# Altium project Carrier-Board-v1.0.PrjPcb (part 6 of 15)

## Sheet USB-C_INTERFACE.SchDoc
size A4; SheetNumber: 12; SheetTotal: 27
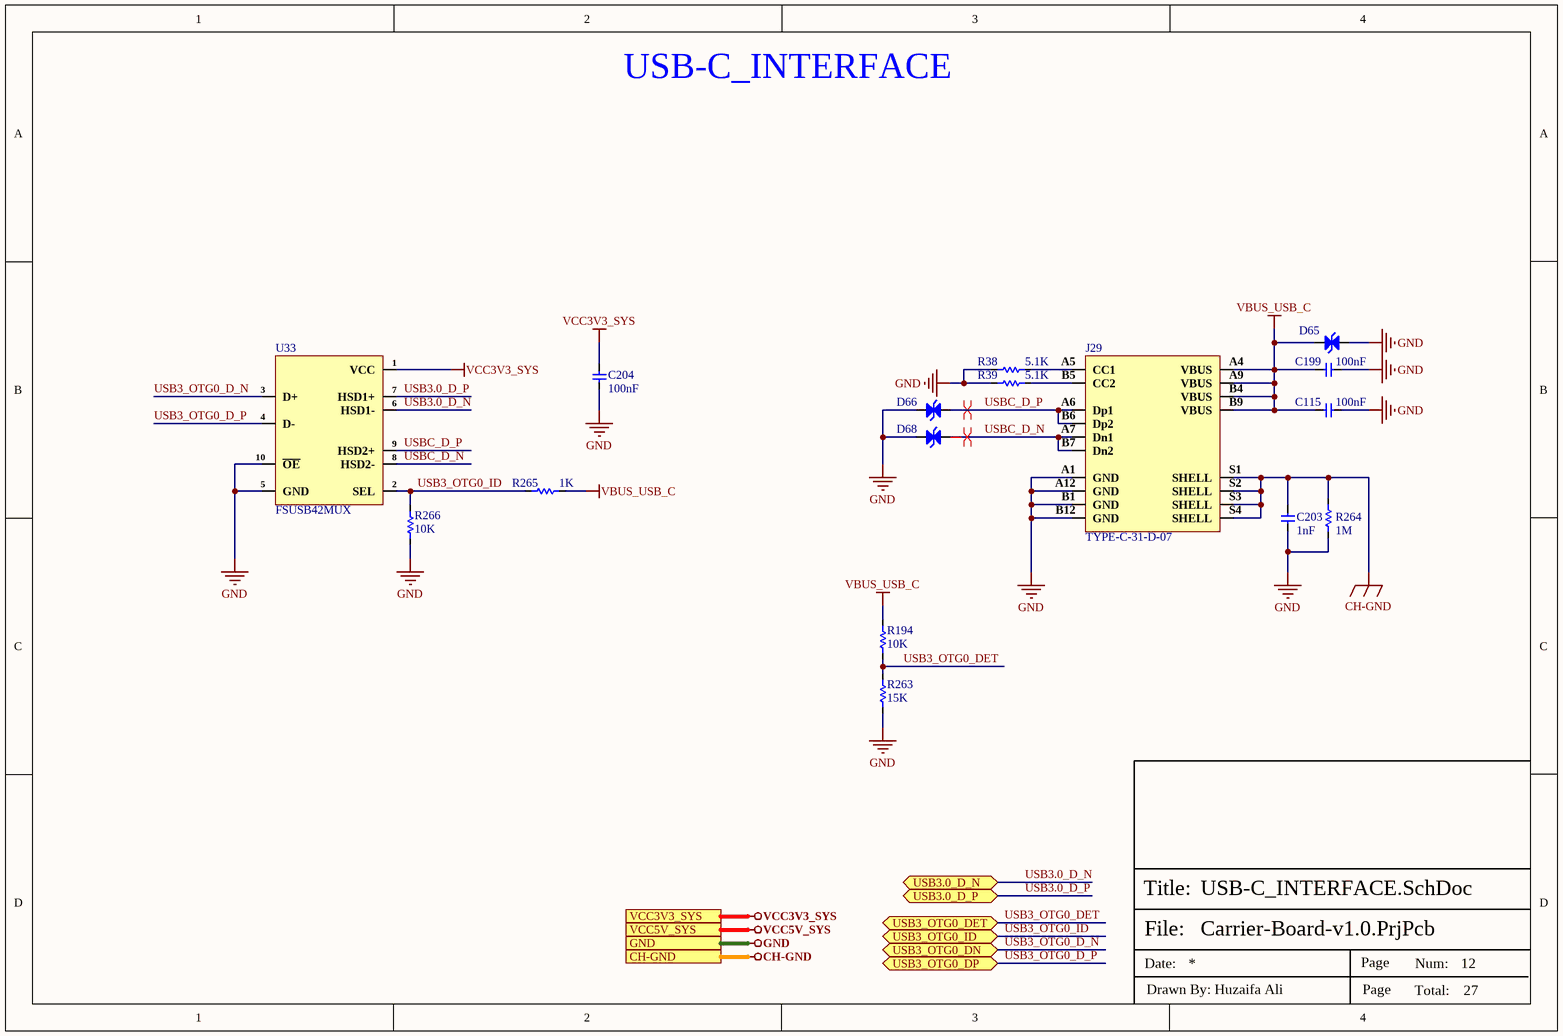
[diagram p11: USB-C_INTERFACE.SchDoc]

### Parts
C115  100nF  [Cap-0402]
C199  100nF  [Cap-0402]
C203  1nF  [Cap-1206]
C204  100nF  [Cap-0402]
D65  ESD5451N  [DFN1006-2L (Bi-Directional)]  (value not drawn)
D66  ESD5451N  [DFN1006-2L (Bi-Directional)]  (value not drawn)
D68  ESD5451N  [DFN1006-2L (Bi-Directional)]  (value not drawn)
J29  TYPE-C-31-D-07  [TYPE-C-31-D-07]
R38  5.1K  [Res-0402]
R39  5.1K  [Res-0402]
R194  10K  [Res-0402]
R263  15K  [Res-0402]
R264  1M  [Res-0402]
R265  1K  [Res-0402]
R266  10K  [Res-0402]
U33  FSUSB42MUX  [10-MSOP]

### Ports
CH-GND (see TOP SHEET[3D], ETHERNET_PHY0[4D], ETHERNET_PHY1[4D], HDMI_INTERFACE[3D], MICRO_SD_INTERFACE[3D], USB2.0_INTERFACE[3D], USB3.0_INTERFACE[3D]), GND (see TOP SHEET[3D], AUDIO_INTERFACE[1D], BUCK REGULATOR[3D], DEBUG_UART_INTERFACE[3D], DIGITAL IO_RELAY_SHEET[5D], DUAL_SIM_INTERFACE[3D], ETHERNET_PHY0[4D], ETHERNET_PHY1[4D], GSM_INTERFACE[2D], HDMI_INTERFACE[3D], INPUT_PROTECTION[3D], LINEAR_VOLTAGE_REG[3D], MICRO_SD_INTERFACE[3D], MIPI-DSI DISPLAY[3D], POWER SECTION[3D], PUSH BUTTONs_INTERFACE[3C], RGB_LEDs_INTERFACE[3D], ROCKCHIP_PWR_SUPPLY[1D], ROCKCHIP_SYSTEM_CONTROL[3C], RS232_RS485_INTERFACE[3C], SENSOR_SHEET[3D], USB2.0_INTERFACE[3D], USB3.0_INTERFACE[3D], WIEGAND_INTERFACE[3D], WIFI_BLUETOOTH_SHEET[4C]), USB3.0_D_N (bidir, see TOP SHEET[3C], USB3.0_INTERFACE[3D]), USB3.0_D_P (bidir, see TOP SHEET[3C], USB3.0_INTERFACE[3D]), USB3_OTG0_DET (bidir, see TOP SHEET[3C], USB3.0_INTERFACE[3D]), USB3_OTG0_DN (bidir, see TOP SHEET[3C], USB3.0_INTERFACE[3D]), USB3_OTG0_DP (bidir, see TOP SHEET[3C], USB3.0_INTERFACE[3D]), USB3_OTG0_ID (bidir, see TOP SHEET[3C], USB3.0_INTERFACE[3D]), VCC3V3_SYS (see TOP SHEET[3C], AUDIO_INTERFACE[1D], BUCK REGULATOR[3D], DEBUG_UART_INTERFACE[3D], DIGITAL IO_RELAY_SHEET[5D], ETHERNET_PHY0[4D], ETHERNET_PHY1[4D], GSM_INTERFACE[2D], HDMI_INTERFACE[3D], LINEAR_VOLTAGE_REG[3D], MIPI-DSI DISPLAY[3D], POWER SECTION[3D], PUSH BUTTONs_INTERFACE[3C], ROCKCHIP_PWR_SUPPLY[1D], ROCKCHIP_SYSTEM_CONTROL[3C], RS232_RS485_INTERFACE[3C], SENSOR_SHEET[3D], WIEGAND_INTERFACE[3D], WIFI_BLUETOOTH_SHEET[4C]), VCC5V_SYS (see TOP SHEET[3C], BUCK REGULATOR[3D], DIGITAL IO_RELAY_SHEET[5D], HDMI_INTERFACE[3D], LINEAR_VOLTAGE_REG[3D], MIPI-DSI DISPLAY[3D], POWER SECTION[3D], RGB_LEDs_INTERFACE[3D], ROCKCHIP_PWR_SUPPLY[1D], USB2.0_INTERFACE[3D], USB3.0_INTERFACE[3D], WIEGAND_INTERFACE[3D])

### Nets
CH-GND: C203.2 J29.S1(SHELL) J29.S2(SHELL) J29.S3(SHELL) J29.S4(SHELL) R264.2 ; port CH-GND
GND: C115.1 C199.1 C203.1 C204.1 D65.1(K) D66.2(K) D68.2(K) J29.A1(GND) J29.A12(GND) J29.B1(GND) J29.B12(GND) R38.1 R39.1 R263.1 R264.1 R266.2 U33.5(GND) U33.10(~{OE}) ; port GND
VBUS_USB_C: C115.2 C199.2 D65.2(K) J29.A4(VBUS) J29.A9(VBUS) J29.B4(VBUS) J29.B9(VBUS) R194.1 R265.2
VCC3V3_SYS: C204.2 U33.1(VCC) ; port VCC3V3_SYS
USB3.0_D_N: U33.6(HSD1-) ; port USB3.0_D_N
USB3.0_D_P: U33.7(HSD1+) ; port USB3.0_D_P
USB3_OTG0_D_N: U33.3(D+) ; port USB3_OTG0_DN
USB3_OTG0_D_P: U33.4(D-) ; port USB3_OTG0_DP
USB3_OTG0_DET: R194.2 R263.2 ; port USB3_OTG0_DET
USB3_OTG0_ID: R265.1 R266.1 U33.2(SEL) ; port USB3_OTG0_ID
USBC_D_N: D68.1(K) J29.A7(Dn1) J29.B7(Dn2) U33.8(HSD2-)
USBC_D_P: D66.1(K) J29.A6(Dp1) J29.B6(Dp2) U33.9(HSD2+)
NetJ29_A5: J29.A5(CC1) R38.2
NetJ29_B5: J29.B5(CC2) R39.2

### Layout directives
differential pair; differential pair class DIFF-USB-90; rule Matched Net Lengths [Tolerance = 0.508mm]; rule Impedance Constraint [Min = 85.00    Max = 95.00    ]: USBC_D_N, USBC_D_P

### Notes on the sheet
- USB-C_INTERFACE
- File:
- Title:
- Date:
- Page
- Num:
- Total:
- Drawn By: Huzaifa Ali

### Library data of the parts
C115 C199 C204 = CC0402KRX5R7BB104: CAP CER 0.1UF 16V X5R 0402; Manufacturer: Yageo; Tolerance: 10%; Supplier 1: Mouser; Manufacturer Part Number: CC0402KRX5R7BB104; RoHS: Yes; Category: Ceramic Capacitors; Stock 1: 936792; Pricing 1: 1=0.10000, 10=0.02300, 50=0.02300, 100=0.01100, 1000=0.00600, 10000=0.00400 (USD); Mount: Surface Mount; Case/Package: 0402; Case Code (Metric): 1005; Case Code (Imperial): 0402; Min Operating Temperature: -55°C; Max Operating Temperature: 85°C; Capacitance: 100nF; Packaging: Tape and Reel; Voltage Rating: 16V; Dielectric: X5R; Termination: SMD/SMT; Voltage Rating (DC): 16V; Package Quantity: 1; Series: CC; Length: 1mm; Width: 0.02inch; Height: 0.5mm; Thickness: 0.022inch; Lead Free: Lead Free; RoHS Compliant: Yes; ComponentLink1URL: https://datasheet.ciiva.com/155/mlccorderingcode-155879.pdf?src-supplier=Digi-Key; ComponentLink1Description: https://datasheet.ciiva.com/155/mlccorderingcode-155879.pdf?src-supplier=Digi-Key; ComponentLink2URL: https://datasheet.ciiva.com/155/mlccorderingcode-155878.pdf?src-supplier=Digi-Key; ComponentLink2Description: https://datasheet.ciiva.com/155/mlccorderingcode-155878.pdf?src-supplier=Digi-Key; ComponentLink3URL: https://datasheet.ciiva.com/155/mlccorderingcode-155880.pdf?src-supplier=Digi-Key; ComponentLink3Description: https://datasheet.ciiva.com/155/mlccorderingcode-155880.pdf?src-supplier=Digi-Key; ComponentLink4URL: https://datasheet.ciiva.com/11464/upy-gphc-x5r-4v-to-50v-12-11464869.pdf?src-supplier=Avnet; ComponentLink4Description: https://datasheet.ciiva.com/11464/upy-gphc-x5r-4v-to-50v-12-11464869.pdf?src-supplier=Avnet; Supplier Part Number 1: 603-CC402KRX5R7BB104; LCSC Part Number: C106204; Number of Pins: 2; Resistor Type: Ceramic; Construction: Flat; Depth: 0.5mm; Radiation Hardening: No; REACH SVHC: Unknown; Halogen Free: Halogen Free
C203 = CC1206KKX7RDBB102: CAP CER 1000PF 2KV X7R 1206; Manufacturer: Yageo; Tolerance: 10%; Dissipation Factor: 2.5%; Insulation Resistance: 10GR; Item Type: Capacitor; Manufacturer Part Number: CC1206KKX7RDBB102; RoHS: Yes; Category: Ceramic Capacitors; Case/Package: 1206; Case Code (Metric): 3216; Case Code (Imperial): 1206; Min Operating Temperature: -55°C; Max Operating Temperature: 125°C; Voltage Rating: 2kV; Packaging: Tape and Reel; Dielectric: X7R; Termination: SMD/SMT; Voltage Rating (DC): 2kV; Series: CC; Construction: Flat; Length: 3.2mm; RoHS Compliant: Yes; ComponentLink1URL: https://datasheet.ciiva.com/23942/1449957-23942422.pdf?src-supplier=Newark; ComponentLink1Description: https://datasheet.ciiva.com/23942/1449957-23942422.pdf?src-supplier=Newark; ComponentLink2URL: https://datasheet.ciiva.com/186/upy-np0x7r-hv-1kv-to-3kv-4-186736.pdf?src-supplier=Digi-Key; ComponentLink2Description: https://datasheet.ciiva.com/186/upy-np0x7r-hv-1kv-to-3kv-4-186736.pdf?src-supplier=Digi-Key; ComponentLink3URL: https://datasheet.ciiva.com/186/upy-np0x7r-hv-1kv-to-3kv-4-186737.pdf?src-supplier=Digi-Key; ComponentLink3Description: https://datasheet.ciiva.com/186/upy-np0x7r-hv-1kv-to-3kv-4-186737.pdf?src-supplier=Digi-Key; ComponentLink4URL: https://datasheet.ciiva.com/13386/upy-gp-np0-16v-to-50v-8-13386312.pdf?src-supplier=Mouser; ComponentLink4Description: https://datasheet.ciiva.com/13386/upy-gp-np0-16v-to-50v-8-13386312.pdf?src-supplier=Mouser; ComponentLink5URL: https://datasheet.ciiva.com/186/upy-np0x7r-hv-1kv-to-3kv-4-186735.pdf?src-supplier=Digi-Key; ComponentLink5Description: https://datasheet.ciiva.com/186/upy-np0x7r-hv-1kv-to-3kv-4-186735.pdf?src-supplier=Digi-Key; Supplier 1: Digi-Key; Stock 1: 19260; Pricing 1: 1=0.35000, 10=0.24000, 50=0.16780, 100=0.14390, 500=0.10794, 1000=0.09114 (USD); Mount: Surface Mount; Number of Pins: 2; Capacitance: 1nF; Voltage: 2kV; Package Quantity: 1; Resistor Type: Ceramic; Width: 0.063inch; Height: 1.25mm; Depth: 1.6mm; Thickness: 0.057inch; Radiation Hardening: No; REACH SVHC: Unknown; Lead Free: Lead Free; Supplier Part Number 1: 311-1487-1-ND; LCSC Part Number: C23631
D65 D66 D68 = ESD5451N: DFN1006-2(0402) ESD Protection Devices ROHS; Manufacturer: TECH PUBLIC; Manufacturer Part Number: ESD5451N; Footprint: DFN1006-2(0402); ComponentLink1Description: LCSC; ComponentLink1URL: https://www.lcsc.com/product-detail/span-style-background-color-ff0-ESD-span-Protection-Devices_TECH-PUBLIC-ESD5451N_C2936977.html; LCSC Part Number: C2936977
J29 = TYPE-C-31-D-07: 1 Brick nogging 14P Female Type-C SMD USB Connectors ROHS; Manufacturer: Korean Hroparts Elec; Manufacturer Part Number: TYPE-C-31-D-07; Package: SMD; Item Type: USB Connector; ComponentLink1Description: LCSC; ComponentLink1URL: https://www.lcsc.com/product-detail/USB-Connectors_Korean-Hroparts-Elec-TYPE-C-31-D-07_C2689965.html
R38 R39 = RC0402FR-075K1L: RES 5.1K OHM 1% 1/16W 0402; Manufacturer: Yageo; Power Rating: 63mW; Resistance: 5.1kR; Temperature Coefficient: 100ppm/°C; Voltage Rating: 50V; Item Type: Resistor; Supplier 1: Avnet; Manufacturer Part Number: RC0402FR-075K1L; RoHS: Yes; Category: Chip SMD Resistors; Stock 1: 65000; Pricing 1: 10000=0.00085 (USD); Case/Package: 0402; Case Code (Metric): 1005; Case Code (Imperial): 0402; Min Operating Temperature: -55°C; Max Operating Temperature: 155°C; Tolerance: 1%; Technology: THICK FILM; Packaging: Tape and Reel; Package Quantity: 1; Resistor Type: Thick Film; Number of Terminations: 2; Termination: SMD/SMT; Max Power Dissipation: 63mW; Voltage Rating (DC): 50V; Working Voltage: 50V; Features: Moisture Resistant; Series: RC; Resistance Tolerance: 1%; Construction: Rectangular; Length: 1mm; Width: 0.02inch; Height: 0.016inch; Depth: 0.5mm; RoHS Compliant: Yes; Military Standard: Not; Lead Free: Lead Free; ComponentLink1URL: https://datasheet.ciiva.com/7983/1018594-7983519.pdf?src-supplier=Element14; ComponentLink1Description: https://datasheet.ciiva.com/7983/1018594-7983519.pdf?src-supplier=Element14; ComponentLink2URL: https://datasheet.ciiva.com/46394/1018594-46394936.pdf?src-supplier=Element14; ComponentLink2Description: https://datasheet.ciiva.com/46394/1018594-46394936.pdf?src-supplier=Element14; ComponentLink3URL: https://datasheet.ciiva.com/2453/pyu-r-int-thick-7-2453401.pdf?src-supplier=Digi-Key; ComponentLink3Description: https://datasheet.ciiva.com/2453/pyu-r-int-thick-7-2453401.pdf?src-supplier=Digi-Key; ComponentLink4URL: https://datasheet.ciiva.com/2453/pyu-r-int-thick-7-2453402.pdf?src-supplier=Digi-Key; ComponentLink4Description: https://datasheet.ciiva.com/2453/pyu-r-int-thick-7-2453402.pdf?src-supplier=Digi-Key; ComponentLink5URL: https://datasheet.ciiva.com/2453/pyu-r-int-thick-7-2453400.pdf?src-supplier=Digi-Key; ComponentLink5Description: https://datasheet.ciiva.com/2453/pyu-r-int-thick-7-2453400.pdf?src-supplier=Digi-Key; ComponentLink6URL: https://datasheet.ciiva.com/12558/pyu-rc0402-51-rohs-l-6-r-8721-12558460.pdf?src-supplier=Mouser; ComponentLink6Description: https://datasheet.ciiva.com/12558/pyu-rc0402-51-rohs-l-6-r-8721-12558460.pdf?src-supplier=Mouser; ComponentLink7URL: https://datasheet.ciiva.com/16744/pyu-rc0402-51-rohs-l-6-r-16744283.pdf?src-supplier=Future+Electronics; ComponentLink7Description: https://datasheet.ciiva.com/16744/pyu-rc0402-51-rohs-l-6-r-16744283.pdf?src-supplier=Future+Electronics; ComponentLink8URL: https://datasheet.ciiva.com/15189/getdatasheetpartid-323636-15189493.pdf?src-supplier=Verical; ComponentLink8Description: https://datasheet.ciiva.com/15189/getdatasheetpartid-323636-15189493.pdf?src-supplier=Verical; Supplier Part Number 1: RC0402FR-075K1L; LCSC Part Number: C105872
R194 R266 = RC0402FR-0710KL: RES 10K OHM 1% 1/16W 0402; Manufacturer: Yageo; Max Power Dissipation: 63mW; Temperature Coefficient: 100ppm/°C; Resistance: 10kR; Voltage Rating (DC): 50V; Power Rating: 62.5mW; Item Type: Resistor; Manufacturer Part Number: RC0402FR-0710KL; RoHS: Yes; Category: Chip SMD Resistors; Case/Package: 0402; Case Code (Imperial): 0402; Case Code (Metric): 1005; Min Operating Temperature: -55°C; Max Operating Temperature: 155°C; Features: Moisture Resistant; Packaging: Tape and Reel; Tolerance: 1%; Number of Terminations: 2; Series: RC; RoHS Compliant: Yes; ComponentLink1URL: https://datasheet.ciiva.com/7660/38568-7660787.pdf?src-supplier=Element14; ComponentLink1Description: https://datasheet.ciiva.com/7660/38568-7660787.pdf?src-supplier=Element14; Supplier 1: Mouser; Stock 1: 18648329; Pricing 1: 1=0.10000, 10=0.01400, 50=0.01400, 100=0.00500, 1000=0.00300, 10000=0.00200 (USD); Number of Pins: 2; Resistor Type: Thick Film; Voltage Rating: 50V; Termination: SMD/SMT; Resistance Tolerance: 1%; Construction: Rectangular; Length: 1mm; Width: 0.5mm; Height: 0.32mm; Depth: 0.5mm; Lead Pitch: 0.2mm; REACH SVHC: No SVHC; Lead Free: Lead Free; Military Standard: Not; ComponentLink2URL: https://datasheet.ciiva.com/7849/1686128-7849814.pdf?src-supplier=Element14; ComponentLink2Description: https://datasheet.ciiva.com/7849/1686128-7849814.pdf?src-supplier=Element14; ComponentLink3URL: https://datasheet.ciiva.com/7983/1018594-7983486.pdf?src-supplier=Element14; ComponentLink3Description: https://datasheet.ciiva.com/7983/1018594-7983486.pdf?src-supplier=Element14; ComponentLink4URL: https://datasheet.ciiva.com/22747/1018594-22747512.pdf?src-supplier=Element14; ComponentLink4Description: https://datasheet.ciiva.com/22747/1018594-22747512.pdf?src-supplier=Element14; ComponentLink5URL: https://datasheet.ciiva.com/12667/pyu-rc0402-51-rohs-l-6-r-12667067.pdf?src-supplier=Mouser; ComponentLink5Description: https://datasheet.ciiva.com/12667/pyu-rc0402-51-rohs-l-6-r-12667067.pdf?src-supplier=Mouser; ComponentLink6URL: https://datasheet.ciiva.com/7849/1784430-7849813.pdf?src-supplier=Element14; ComponentLink6Description: https://datasheet.ciiva.com/7849/1784430-7849813.pdf?src-supplier=Element14; Supplier Part Number 1: 603-RC0402FR-0710KL; LCSC Part Number: C60490; Working Voltage: 50V; ComponentLink7URL: https://datasheet.ciiva.com/7849/1784430-7849815.pdf?src-supplier=Element14; ComponentLink7Description: https://datasheet.ciiva.com/7849/1784430-7849815.pdf?src-supplier=Element14
R263 = RT0402BRD0715KL: RES SMD 15K OHM 0.1% 1/16W 0402; Manufacturer: Yageo; Item Type: Resistor; Supplier: Arrow Electronics; Supplier Part Number: RT0402BRD0715KL; Manufacturer Part Number: RT0402BRD0715KL; RoHS: Yes; Category: Chip SMD Resistors; Stock: 10000; Pricing: 10000=0.0361, 30000=0.0357, 50000=0.0243, 100000=0.0205 (USD); ComponentLink1URL: https://datasheet.ciiva.com/12723/pyu-rt-1-to-0-05-rohs-l-4-12723782.pdf?src-supplier=Mouser; ComponentLink1Description: https://datasheet.ciiva.com/12723/pyu-rt-1-to-0-05-rohs-l-4-12723782.pdf?src-supplier=Mouser; ComponentLink2URL: https://datasheet.ciiva.com/2582/pyu-rt-1-to-0-05-rohs-l-5-2582151.pdf?src-supplier=Digi-Key; ComponentLink2Description: https://datasheet.ciiva.com/2582/pyu-rt-1-to-0-05-rohs-l-5-2582151.pdf?src-supplier=Digi-Key; LCSC Part Number: C852545
R264 = AF0402JR-071ML: RES SMD 1M OHM 5% 1/16W 0402; Manufacturer: Yageo; Temperature Coefficient: 100ppm/°C; Resistance: 1MR; Item Type: Resistor; Max Power Dissipation: 63mW; Manufacturer Part Number: AF0402JR-071ML; Case/Package: 0402; Min Operating Temperature: -55°C; Max Operating Temperature: 155°C; Packaging: Tape and Reel; Tolerance: 5%; Height: 0.015inch; ComponentLink1URL: https://www.yageo.com/upload/media/product/productsearch/datasheet/rchip/PYu-AF_51_RoHS_L_6.pdf?src-supplier=Digi-Key; ComponentLink1Description: https://www.yageo.com/upload/media/product/productsearch/datasheet/rchip/PYu-AF_51_RoHS_L_6.pdf?src-supplier=Digi-Key; Supplier 1: Digi-Key; Stock 1: 0; Pricing 1: 10000=0.00408 (USD); Length: 0.039inch; Width: 0.02inch; Supplier Part Number 1: AF0402JR-071ML-ND; LCSC Part Number: C144054; Resistor Type: Thick Film; Number of Terminations: 2; Features: Moisture Resistant,Anti-Sulfur; RoHS Compliant: Yes
R265 = RC0402FR-071KL: RES 1K OHM 1% 1/16W 0402; Manufacturer: Yageo; Resistance: 1kR; Temperature Coefficient: 100ppm/°C; Voltage Rating (DC): 50V; Power Rating: 62.5mW; Max Power Dissipation: 63mW; Item Type: Resistor; Supplier 1: Avnet; Manufacturer Part Number: RC0402FR-071KL; RoHS: Yes; Category: Chip SMD Resistors; Stock 1: 13030000; Pricing 1: 10000=0.00085, 20000=0.00087, 40000=0.00084, 60000=0.00083, 80000=0.00079, 100000=0.00078, 1000000=0.00076 (USD); Case/Package: 0402; Number of Pins: 2; Case Code (Imperial): 0402; Case Code (Metric): 1005; Size Code: 0402; Min Operating Temperature: -55°C; Max Operating Temperature: 155°C; Resistor Type: Thick Film; Tolerance: 1%; Packaging: Tape and Reel; Voltage Rating: 50V; Termination: SMD/SMT; Features: Moisture Resistant; Series: RC; Number of Terminations: 2; Resistance Tolerance: 1%; Construction: Rectangular; Technology: THICK FILM; Length: 1mm; Width: 0.5mm; Height: 0.32mm; Depth: 0.5mm; Reach SVHC Compliant: Yes; Lead Free: Lead Free; RoHS Compliant: Yes; Military Standard: Not; ComponentLink1URL: https://datasheet.ciiva.com/11819/0900766b80c66297-11819477.pdf?src-supplier=RSComponents; ComponentLink1Description: https://datasheet.ciiva.com/11819/0900766b80c66297-11819477.pdf?src-supplier=RSComponents; ComponentLink2URL: https://datasheet.ciiva.com/7983/1018594-7983502.pdf?src-supplier=Element14; ComponentLink2Description: https://datasheet.ciiva.com/7983/1018594-7983502.pdf?src-supplier=Element14; ComponentLink3URL: https://datasheet.ciiva.com/22747/1018594-22747513.pdf?src-supplier=Element14; ComponentLink3Description: https://datasheet.ciiva.com/22747/1018594-22747513.pdf?src-supplier=Element14; ComponentLink4URL: https://datasheet.ciiva.com/12666/pyu-rc0402-51-rohs-l-6-r-12666741.pdf?src-supplier=Mouser; ComponentLink4Description: https://datasheet.ciiva.com/12666/pyu-rc0402-51-rohs-l-6-r-12666741.pdf?src-supplier=Mouser; ComponentLink5URL: https://datasheet.ciiva.com/7849/1018594-7849869.pdf?src-supplier=Element14; ComponentLink5Description: https://datasheet.ciiva.com/7849/1018594-7849869.pdf?src-supplier=Element14; ComponentLink6URL: https://datasheet.ciiva.com/7849/1018594-7849871.pdf?src-supplier=Element14; ComponentLink6Description: https://datasheet.ciiva.com/7849/1018594-7849871.pdf?src-supplier=Element14; ComponentLink7URL: https://datasheet.ciiva.com/17063/pyu-rc0402-51-rohs-l-6-r-17063193.pdf?src-supplier=Future+Electronics; ComponentLink7Description: https://datasheet.ciiva.com/17063/pyu-rc0402-51-rohs-l-6-r-17063193.pdf?src-supplier=Future+Electronics; Supplier Part Number 1: RC0402FR-071KL; LCSC Part Number: C106235
U33 = FSUSB42MUX: IC USB SWITCH DPDT 10MSOP; Manufacturer: ON Semiconductor / Fairchild; Interface: 224,1532Interface; Nominal Supply Current: 1uA; Number of Circuits: 2NUMBER; Value: 6.5R; Supplier: Avnet; Supplier Part Number: 08AK6019; Manufacturer Part Number: FSUSB42MUX; RoHS: Yes; Item Type: IC; Stock: 4000; Pricing: 1=0.842, 25=0.766, 50=0.646, 100=0.524, 250=0.512 (USD); ComponentLink1URL: https://datasheet.ciiva.com/3232/fsusb42-3232662.pdf?src-supplier=Avnet; ComponentLink1Description: https://datasheet.ciiva.com/3232/fsusb42-3232662.pdf?src-supplier=Avnet; ComponentLink2URL: https://datasheet.ciiva.com/3233/fsusb42-3233258.pdf?src-supplier=Avnet; ComponentLink2Description: https://datasheet.ciiva.com/3233/fsusb42-3233258.pdf?src-supplier=Avnet; ComponentLink3URL: https://datasheet.ciiva.com/4924/fsusb42-112719-4924269.pdf?src-supplier=Mouser; ComponentLink3Description: https://datasheet.ciiva.com/4924/fsusb42-112719-4924269.pdf?src-supplier=Mouser; ComponentLink4URL: https://datasheet.ciiva.com/1666/fsusb42-1666347.pdf?src-supplier=Digikey; ComponentLink4Description: https://datasheet.ciiva.com/1666/fsusb42-1666347.pdf?src-supplier=Digikey; ComponentLink5URL: https://datasheet.ciiva.com/1666/fsusb42-1666348.pdf?src-supplier=Digikey; ComponentLink5Description: https://datasheet.ciiva.com/1666/fsusb42-1666348.pdf?src-supplier=Digikey; ComponentLink6URL: https://datasheet.ciiva.com/1666/fsusb42-1666349.pdf?src-supplier=Digikey; ComponentLink6Description: https://datasheet.ciiva.com/1666/fsusb42-1666349.pdf?src-supplier=Digikey; LCSC Part Number: C11355